# EAGLE design Callisto_Teknic_MSO_LSI_Relay_x_4 (EAGLE 9.6.2)
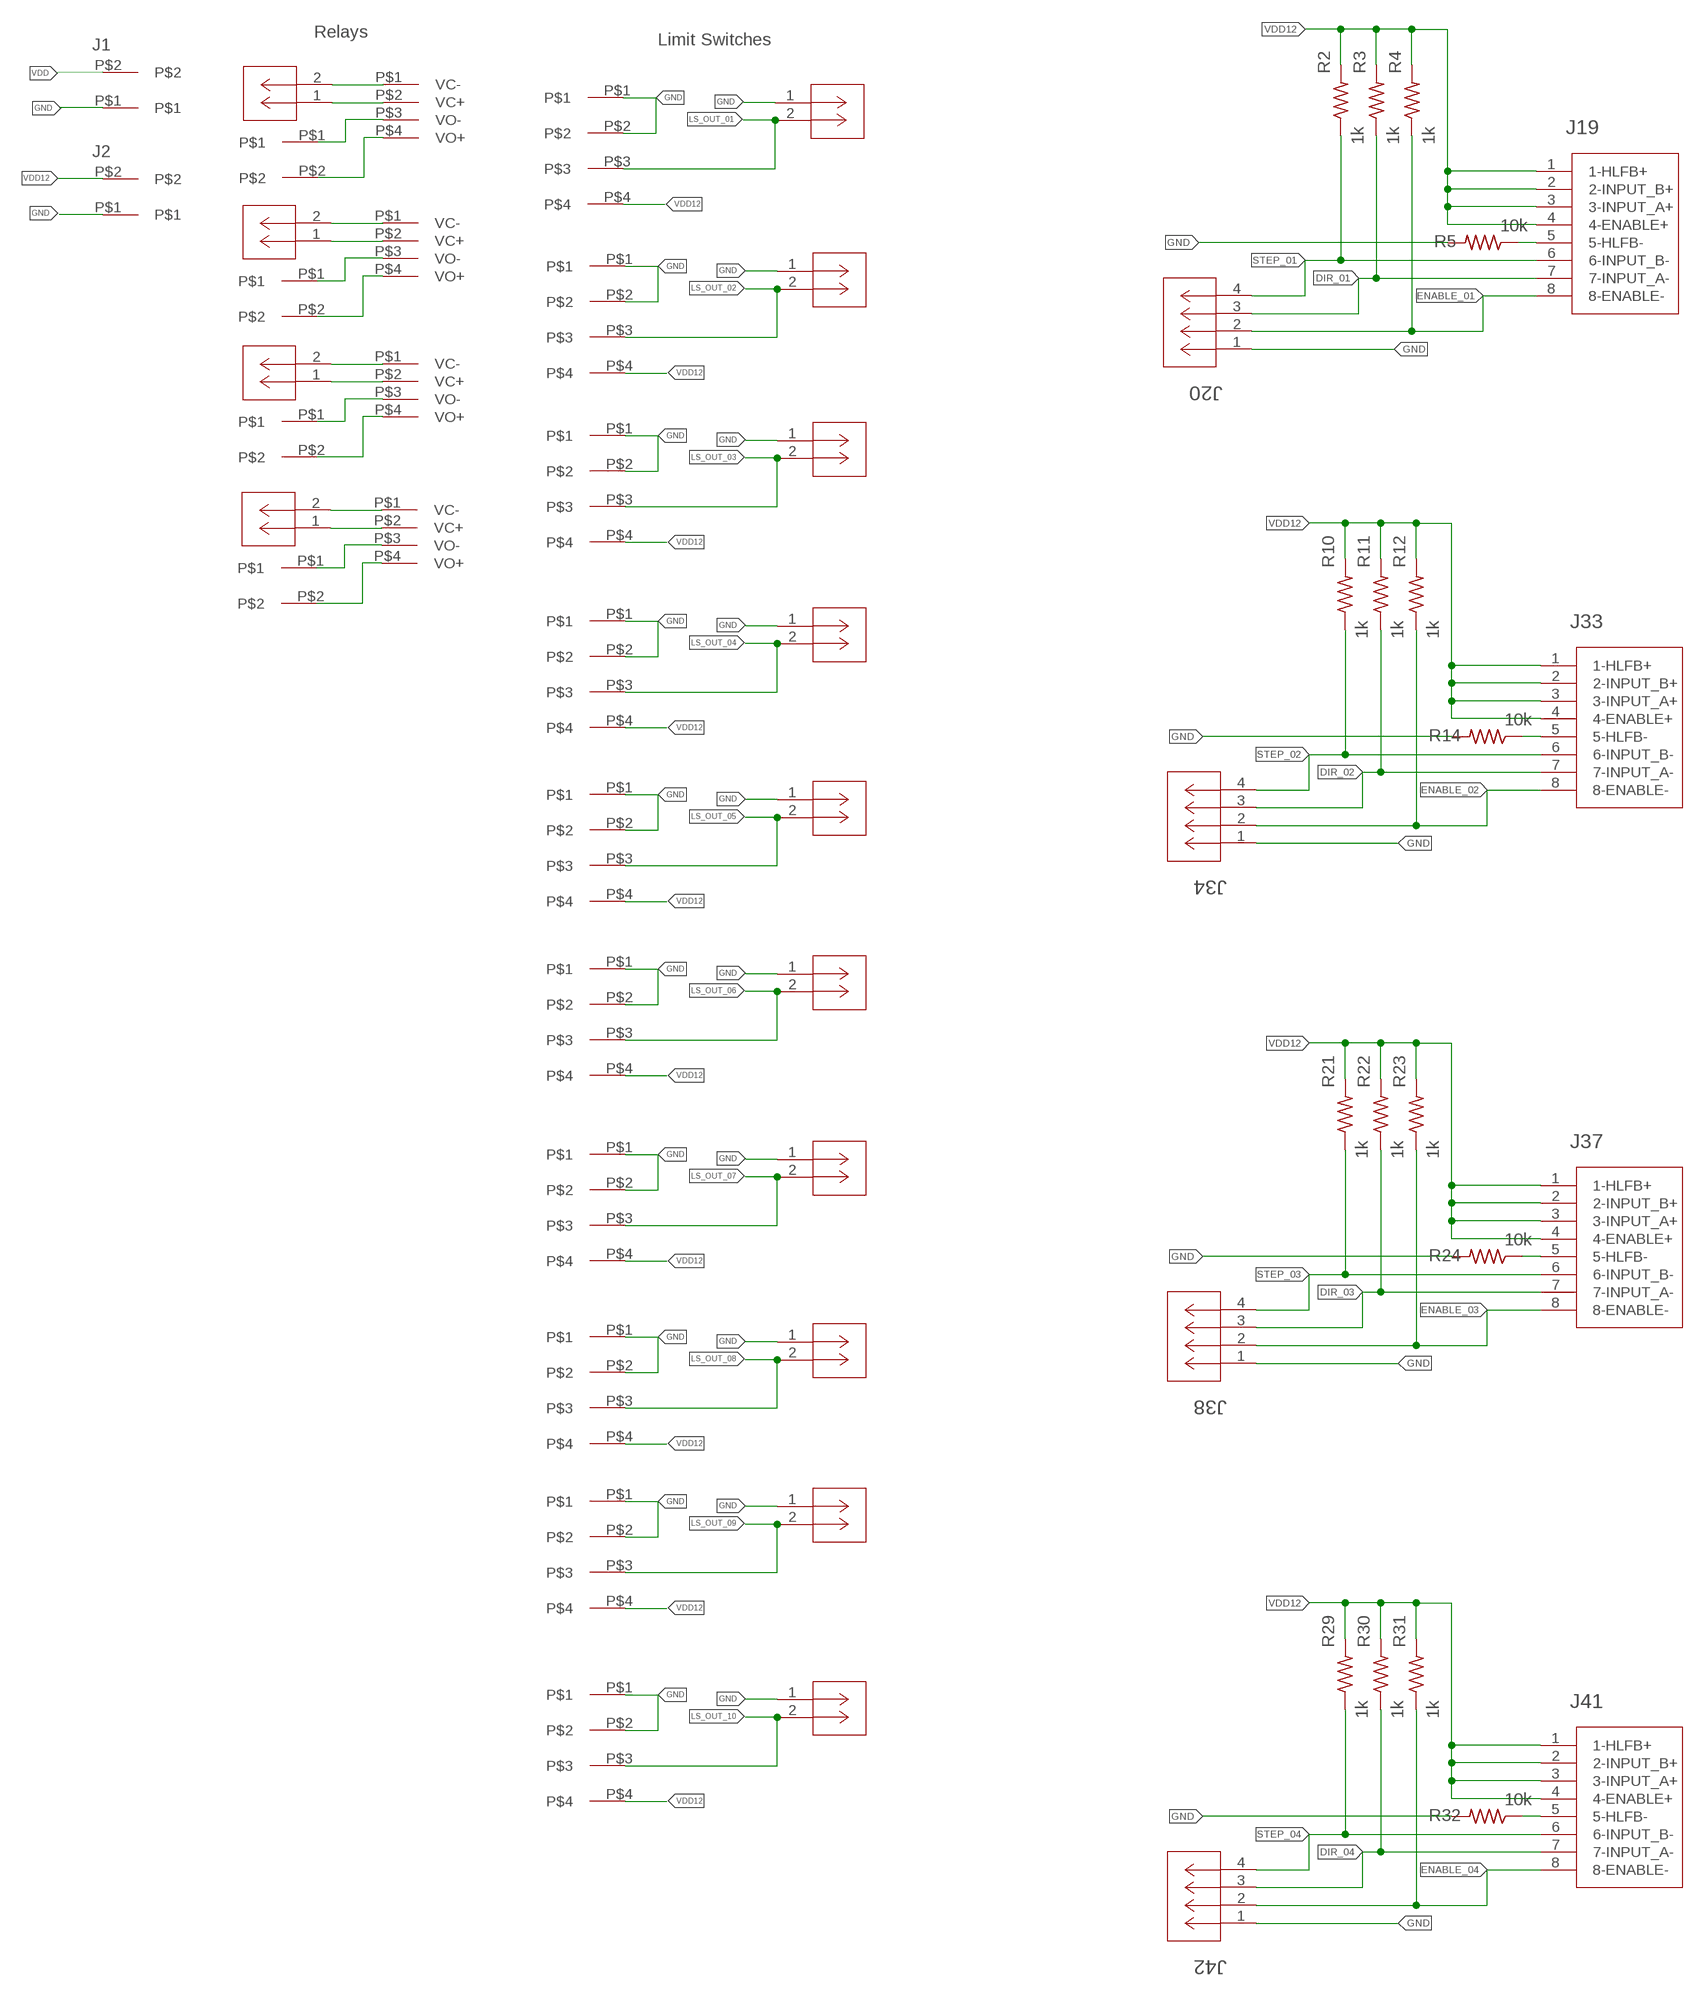
[diagram p0: schematic, sheet 1, part 1 of 2]
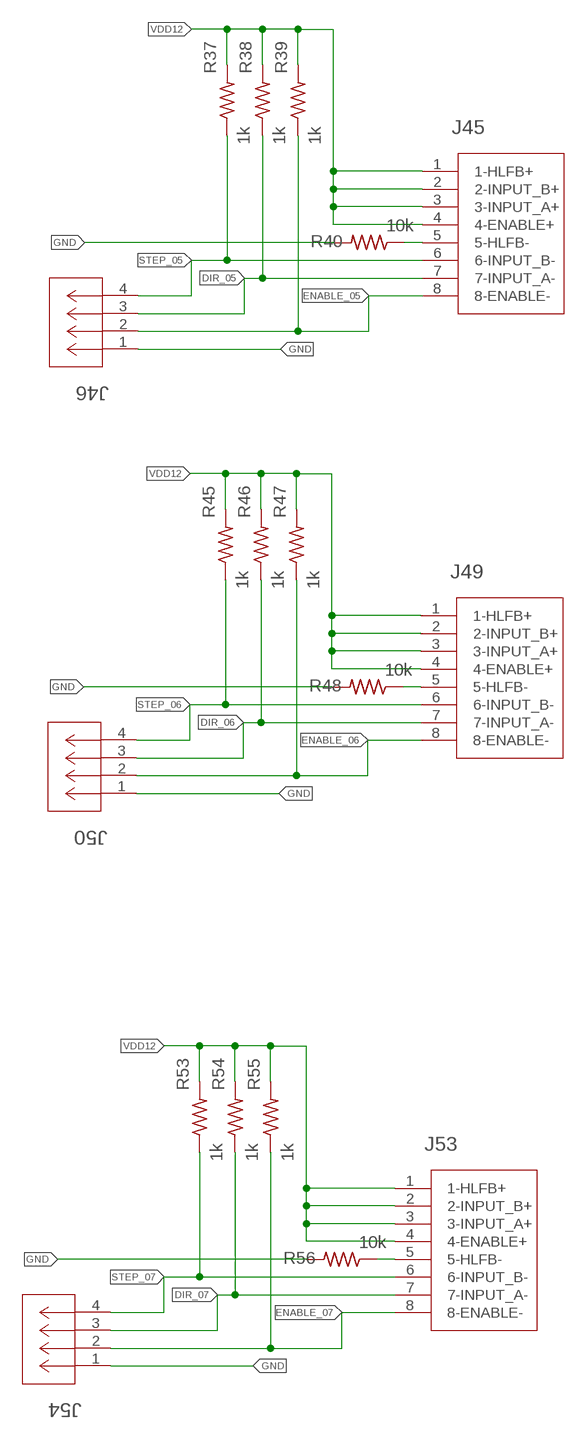
[diagram p1: schematic, sheet 1, part 2 of 2]

## Parts
J1  2-pos  3.81MM_1_X_2_RT_ANGLE_PLUG_HEADER  [2_3.81MM_PITCH]
J2  2-pos  3.81MM_1_X_2_RT_ANGLE_PLUG_HEADER  [2_3.81MM_PITCH]
J4  CONN_530470210_PICOBLADE_X_2  [CON_530470210_MOL]
J5  2-pos  3.81MM_1_X_2_RT_ANGLE_PLUG_HEADER  [2_3.81MM_PITCH]
J6  CONN_530470210_PICOBLADE_X_2  [CON_530470210_MOL]
J7  2-pos  3.81MM_1_X_2_RT_ANGLE_PLUG_HEADER  [2_3.81MM_PITCH]
J8  CONN_530470210_PICOBLADE_X_2  [CON_530470210_MOL]
J9  2-pos  3.81MM_1_X_2_RT_ANGLE_PLUG_HEADER  [2_3.81MM_PITCH]
J10  CONN_530470210_PICOBLADE_X_2  [CON_530470210_MOL]
J11  2-pos  3.81MM_1_X_2_RT_ANGLE_PLUG_HEADER  [2_3.81MM_PITCH]
J13  CONN_530470210_PICOBLADE_X_2  [CON_530470210_MOL]
J14  4-pos  3.81MM_1_X_4_RT_ANGLE_PLUG_HEADER  [1X4_3.81MM_PITCH]
J15  CONN_530470210_PICOBLADE_X_2  [CON_530470210_MOL]
J16  4-pos  3.81MM_1_X_4_RT_ANGLE_PLUG_HEADER  [1X4_3.81MM_PITCH]
J17  CONN_530470210_PICOBLADE_X_2  [CON_530470210_MOL]
J18  4-pos  3.81MM_1_X_4_RT_ANGLE_PLUG_HEADER  [1X4_3.81MM_PITCH]
J19  TEKNIC_8PIN_MOTOR  [CON_39281083]
J20  CONN_530470410_PICOBLADE_X_4  [CON_530470410_MOL]
J21  CONN_530470210_PICOBLADE_X_2  [CON_530470210_MOL]
J22  4-pos  3.81MM_1_X_4_RT_ANGLE_PLUG_HEADER  [1X4_3.81MM_PITCH]
J23  CONN_530470210_PICOBLADE_X_2  [CON_530470210_MOL]
J24  4-pos  3.81MM_1_X_4_RT_ANGLE_PLUG_HEADER  [1X4_3.81MM_PITCH]
J25  CONN_530470210_PICOBLADE_X_2  [CON_530470210_MOL]
J26  4-pos  3.81MM_1_X_4_RT_ANGLE_PLUG_HEADER  [1X4_3.81MM_PITCH]
J27  CONN_530470210_PICOBLADE_X_2  [CON_530470210_MOL]
J28  4-pos  3.81MM_1_X_4_RT_ANGLE_PLUG_HEADER  [1X4_3.81MM_PITCH]
J29  CONN_530470210_PICOBLADE_X_2  [CON_530470210_MOL]
J30  4-pos  3.81MM_1_X_4_RT_ANGLE_PLUG_HEADER  [1X4_3.81MM_PITCH]
J31  CONN_530470210_PICOBLADE_X_2  [CON_530470210_MOL]
J32  4-pos  3.81MM_1_X_4_RT_ANGLE_PLUG_HEADER  [1X4_3.81MM_PITCH]
J33  TEKNIC_8PIN_MOTOR  [CON_39281083]
J34  CONN_530470410_PICOBLADE_X_4  [CON_530470410_MOL]
J37  TEKNIC_8PIN_MOTOR  [CON_39281083]
J38  CONN_530470410_PICOBLADE_X_4  [CON_530470410_MOL]
J39  CONN_530470210_PICOBLADE_X_2  [CON_530470210_MOL]
J40  4-pos  3.81MM_1_X_4_RT_ANGLE_PLUG_HEADER  [1X4_3.81MM_PITCH]
J41  TEKNIC_8PIN_MOTOR  [CON_39281083]
J42  CONN_530470410_PICOBLADE_X_4  [CON_530470410_MOL]
J45  TEKNIC_8PIN_MOTOR  [CON_39281083]
J46  CONN_530470410_PICOBLADE_X_4  [CON_530470410_MOL]
J49  TEKNIC_8PIN_MOTOR  [CON_39281083]
J50  CONN_530470410_PICOBLADE_X_4  [CON_530470410_MOL]
J53  TEKNIC_8PIN_MOTOR  [CON_39281083]
J54  CONN_530470410_PICOBLADE_X_4  [CON_530470410_MOL]
R2  1k  R_0805  [0805]
R3  1k  R_0805  [0805]
R4  1k  R_0805  [0805]
R5  10k  R_0805  [0805]
R10  1k  R_0805  [0805]
R11  1k  R_0805  [0805]
R12  1k  R_0805  [0805]
R14  10k  R_0805  [0805]
R21  1k  R_0805  [0805]
R22  1k  R_0805  [0805]
R23  1k  R_0805  [0805]
R24  10k  R_0805  [0805]
R29  1k  R_0805  [0805]
R30  1k  R_0805  [0805]
R31  1k  R_0805  [0805]
R32  10k  R_0805  [0805]
R37  1k  R_0805  [0805]
R38  1k  R_0805  [0805]
R39  1k  R_0805  [0805]
R40  10k  R_0805  [0805]
R45  1k  R_0805  [0805]
R46  1k  R_0805  [0805]
R47  1k  R_0805  [0805]
R48  10k  R_0805  [0805]
R53  1k  R_0805  [0805]
R54  1k  R_0805  [0805]
R55  1k  R_0805  [0805]
R56  10k  R_0805  [0805]
U$1  RELAY_KYOTO_KF0604D  [RELAY_KYOTO_KF0604D]
U$2  RELAY_KYOTO_KF0604D  [RELAY_KYOTO_KF0604D]
U$3  RELAY_KYOTO_KF0604D  [RELAY_KYOTO_KF0604D]
U$4  RELAY_KYOTO_KF0604D  [RELAY_KYOTO_KF0604D]

## Nets
DIR_01: J19.7(7-INPUT_A-) J20.3 R3.1
DIR_02: J33.7(7-INPUT_A-) J34.3 R11.1
DIR_03: J37.7(7-INPUT_A-) J38.3 R22.1
DIR_04: J41.7(7-INPUT_A-) J42.3 R30.1
DIR_05: J45.7(7-INPUT_A-) J46.3 R38.1
DIR_06: J49.7(7-INPUT_A-) J50.3 R46.1
DIR_07: J53.7(7-INPUT_A-) J54.3 R54.1
ENABLE_01: J19.8(8-ENABLE-) J20.2 R4.1
ENABLE_02: J33.8(8-ENABLE-) J34.2 R12.1
ENABLE_03: J37.8(8-ENABLE-) J38.2 R23.1
ENABLE_04: J41.8(8-ENABLE-) J42.2 R31.1
ENABLE_05: J45.8(8-ENABLE-) J46.2 R39.1
ENABLE_06: J49.8(8-ENABLE-) J50.2 R47.1
ENABLE_07: J53.8(8-ENABLE-) J54.2 R55.1
GND: J1.P$1 J2.P$1 J13.1 J14.P$1 J14.P$2 J15.1 J16.P$1 J16.P$2 J17.1 J18.P$1 J18.P$2 J20.1 J21.1 J22.P$1 J22.P$2 J23.1 J24.P$1 J24.P$2 J25.1 J26.P$1 J26.P$2 J27.1 J28.P$1 J28.P$2 J29.1 J30.P$1 J30.P$2 J31.1 J32.P$1 J32.P$2 J34.1 J38.1 J39.1 J40.P$1 J40.P$2 J42.1 J46.1 J50.1 J54.1 R5.2 R14.2 R24.2 R32.2 R40.2 R48.2 R56.2
LS_OUT_01: J13.2 J14.P$3
LS_OUT_02: J17.2 J18.P$3
LS_OUT_03: J21.2 J22.P$3
LS_OUT_04: J25.2 J26.P$3
LS_OUT_05: J29.2 J30.P$3
LS_OUT_06: J15.2 J16.P$3
LS_OUT_07: J23.2 J24.P$3
LS_OUT_08: J27.2 J28.P$3
LS_OUT_09: J31.2 J32.P$3
LS_OUT_10: J39.2 J40.P$3
N$2: J19.5(5-HLFB-) R5.1
N$3: J4.1 U$1.P$2(VC+)
N$4: J4.2 U$1.P$1(VC-)
N$5: J5.P$1 U$1.P$3(VO-)
N$6: J5.P$2 U$1.P$4(VO+)
N$7: J6.1 U$2.P$2(VC+)
N$8: J6.2 U$2.P$1(VC-)
N$9: J7.P$1 U$2.P$3(VO-)
N$10: J7.P$2 U$2.P$4(VO+)
N$11: J8.1 U$3.P$2(VC+)
N$12: J8.2 U$3.P$1(VC-)
N$13: J9.P$1 U$3.P$3(VO-)
N$14: J9.P$2 U$3.P$4(VO+)
N$15: J10.1 U$4.P$2(VC+)
N$16: J10.2 U$4.P$1(VC-)
N$17: J11.P$1 U$4.P$3(VO-)
N$18: J11.P$2 U$4.P$4(VO+)
N$20: J33.5(5-HLFB-) R14.1
N$22: J37.5(5-HLFB-) R24.1
N$24: J41.5(5-HLFB-) R32.1
N$26: J45.5(5-HLFB-) R40.1
N$28: J49.5(5-HLFB-) R48.1
N$30: J53.5(5-HLFB-) R56.1
STEP_01: J19.6(6-INPUT_B-) J20.4 R2.1
STEP_02: J33.6(6-INPUT_B-) J34.4 R10.1
STEP_03: J37.6(6-INPUT_B-) J38.4 R21.1
STEP_04: J41.6(6-INPUT_B-) J42.4 R29.1
STEP_05: J45.6(6-INPUT_B-) J46.4 R37.1
STEP_06: J49.6(6-INPUT_B-) J50.4 R45.1
STEP_07: J53.6(6-INPUT_B-) J54.4 R53.1
VDD: J1.P$2
VDD12: J2.P$2 J14.P$4 J16.P$4 J18.P$4 J19.1(1-HLFB+) J19.2(2-INPUT_B+) J19.3(3-INPUT_A+) J19.4(4-ENABLE+) J22.P$4 J24.P$4 J26.P$4 J28.P$4 J30.P$4 J32.P$4 J33.1(1-HLFB+) J33.2(2-INPUT_B+) J33.3(3-INPUT_A+) J33.4(4-ENABLE+) J37.1(1-HLFB+) J37.2(2-INPUT_B+) J37.3(3-INPUT_A+) J37.4(4-ENABLE+) J40.P$4 J41.1(1-HLFB+) J41.2(2-INPUT_B+) J41.3(3-INPUT_A+) J41.4(4-ENABLE+) J45.1(1-HLFB+) J45.2(2-INPUT_B+) J45.3(3-INPUT_A+) J45.4(4-ENABLE+) J49.1(1-HLFB+) J49.2(2-INPUT_B+) J49.3(3-INPUT_A+) J49.4(4-ENABLE+) J53.1(1-HLFB+) J53.2(2-INPUT_B+) J53.3(3-INPUT_A+) J53.4(4-ENABLE+) R2.2 R3.2 R4.2 R10.2 R11.2 R12.2 R21.2 R22.2 R23.2 R29.2 R30.2 R31.2 R37.2 R38.2 R39.2 R45.2 R46.2 R47.2 R53.2 R54.2 R55.2

## Notes on the sheet
- Relays
- Limit Switches

## Library data of the parts
J1 J2 J5 J7 J9 J11 = 3D_MIG_Controller:3.81MM_1_X_2_RT_ANGLE_PLUG_HEADER: TERM BLOCK HDR 2POS 90DEG 3.81MM; PARTNO: 691322310002
J4 J6 J8 J10 J13 J15 J17 J21 J23 J25 J27 J29 J31 J39 = 3D_MIG_Controller:CONN_530470210_PICOBLADE_X_2; COPYRIGHT: Copyright (C) 2022 Ultra Librarian. All rights reserved.; MANUFACTURER_PART_NUMBER: 530470210; MFR_NAME: Molex Connector Corporation
J14 J16 J18 J22 J24 J26 J28 J30 J32 J40 = 3D_MIG_Controller:3.81MM_1_X_4_RT_ANGLE_PLUG_HEADER: 4 Position Terminal Block Header, Male Pins, Shrouded (4 Side) 0.150" (3.81mm) 90°, Right Angle - Through Hole; PARTNO: 691322310004
J19 J33 J37 J41 J45 J49 J53 = 3D_MIG_Controller:TEKNIC_8PIN_MOTOR; COPYRIGHT: Copyright (C) 2022 Ultra Librarian. All rights reserved.; MANUFACTURER_PART_NUMBER: 39281083; MFR_NAME: Molex Connector Corporation
J20 J34 J38 J42 J46 J50 J54 = 3D_MIG_Controller:CONN_530470410_PICOBLADE_X_4; COPYRIGHT: Copyright (C) 2022 Ultra Librarian. All rights reserved.; MANUFACTURER_PART_NUMBER: 530470410; MFR_NAME: Molex Connector Corporation
R2-R5 R10-R12 R14 R21-R24 R29-R32 R37-R40 R45-R48 R53-R56 = 3D_MIG_Controller:R_0805
U$1-U$4 = 3D_MIG_Controller:RELAY_KYOTO_KF0604D

## Board
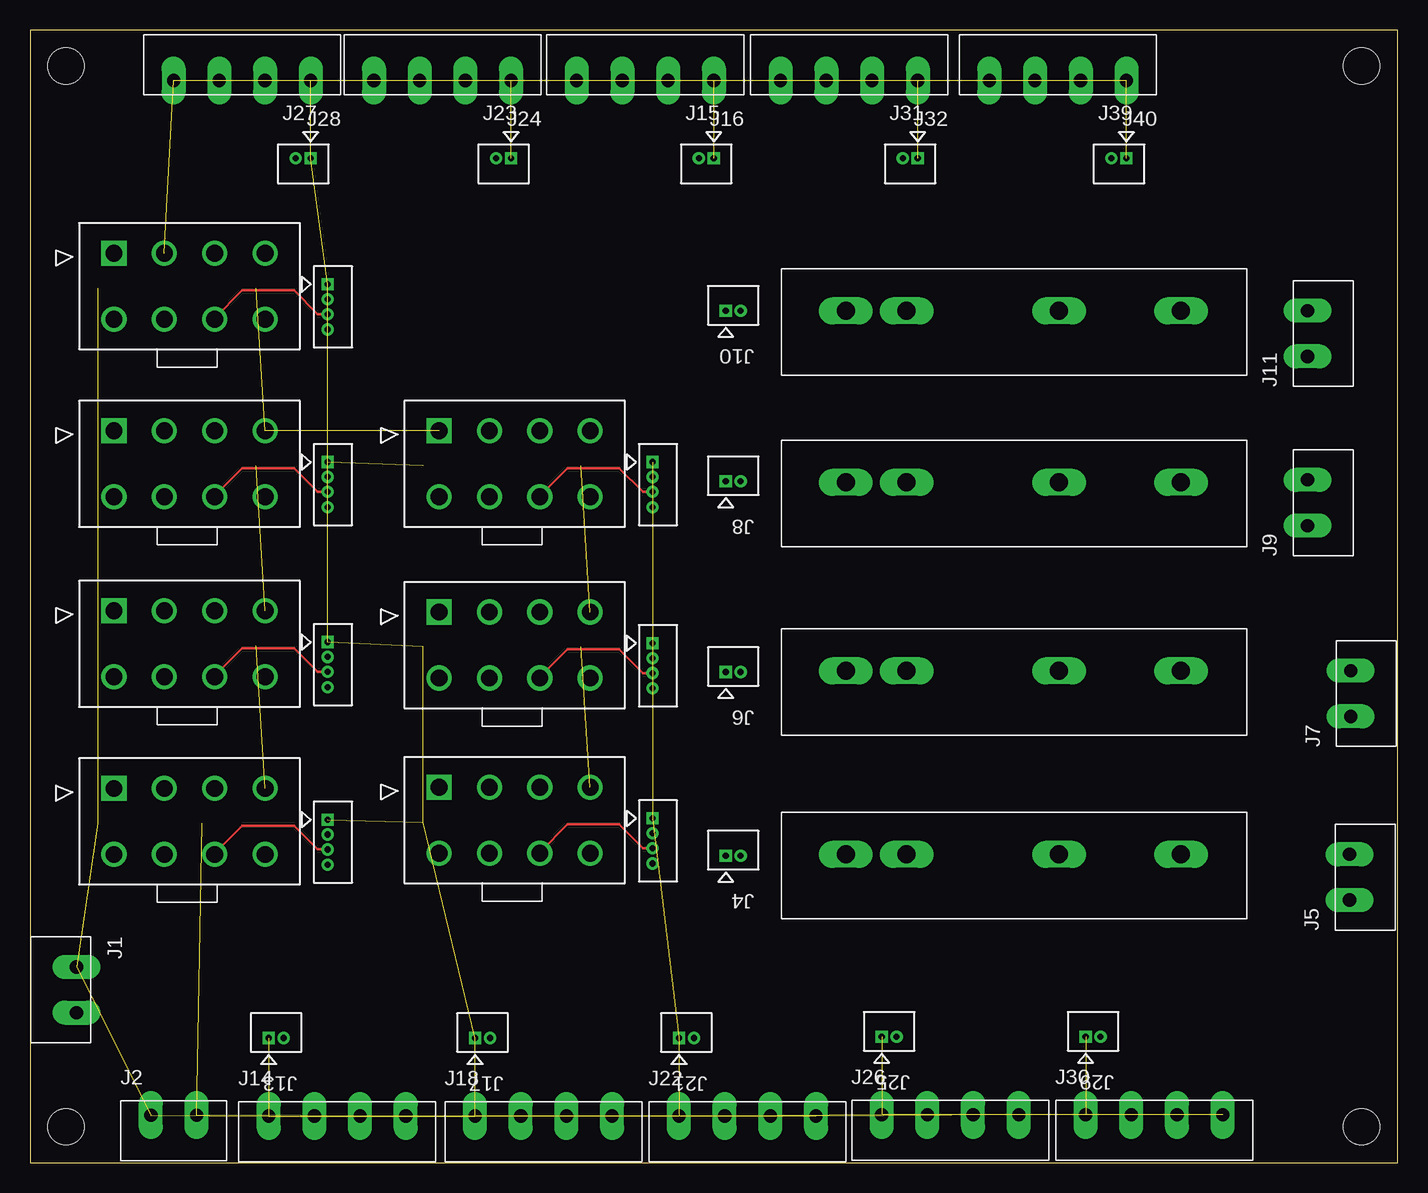
[diagram p2: board, top side]
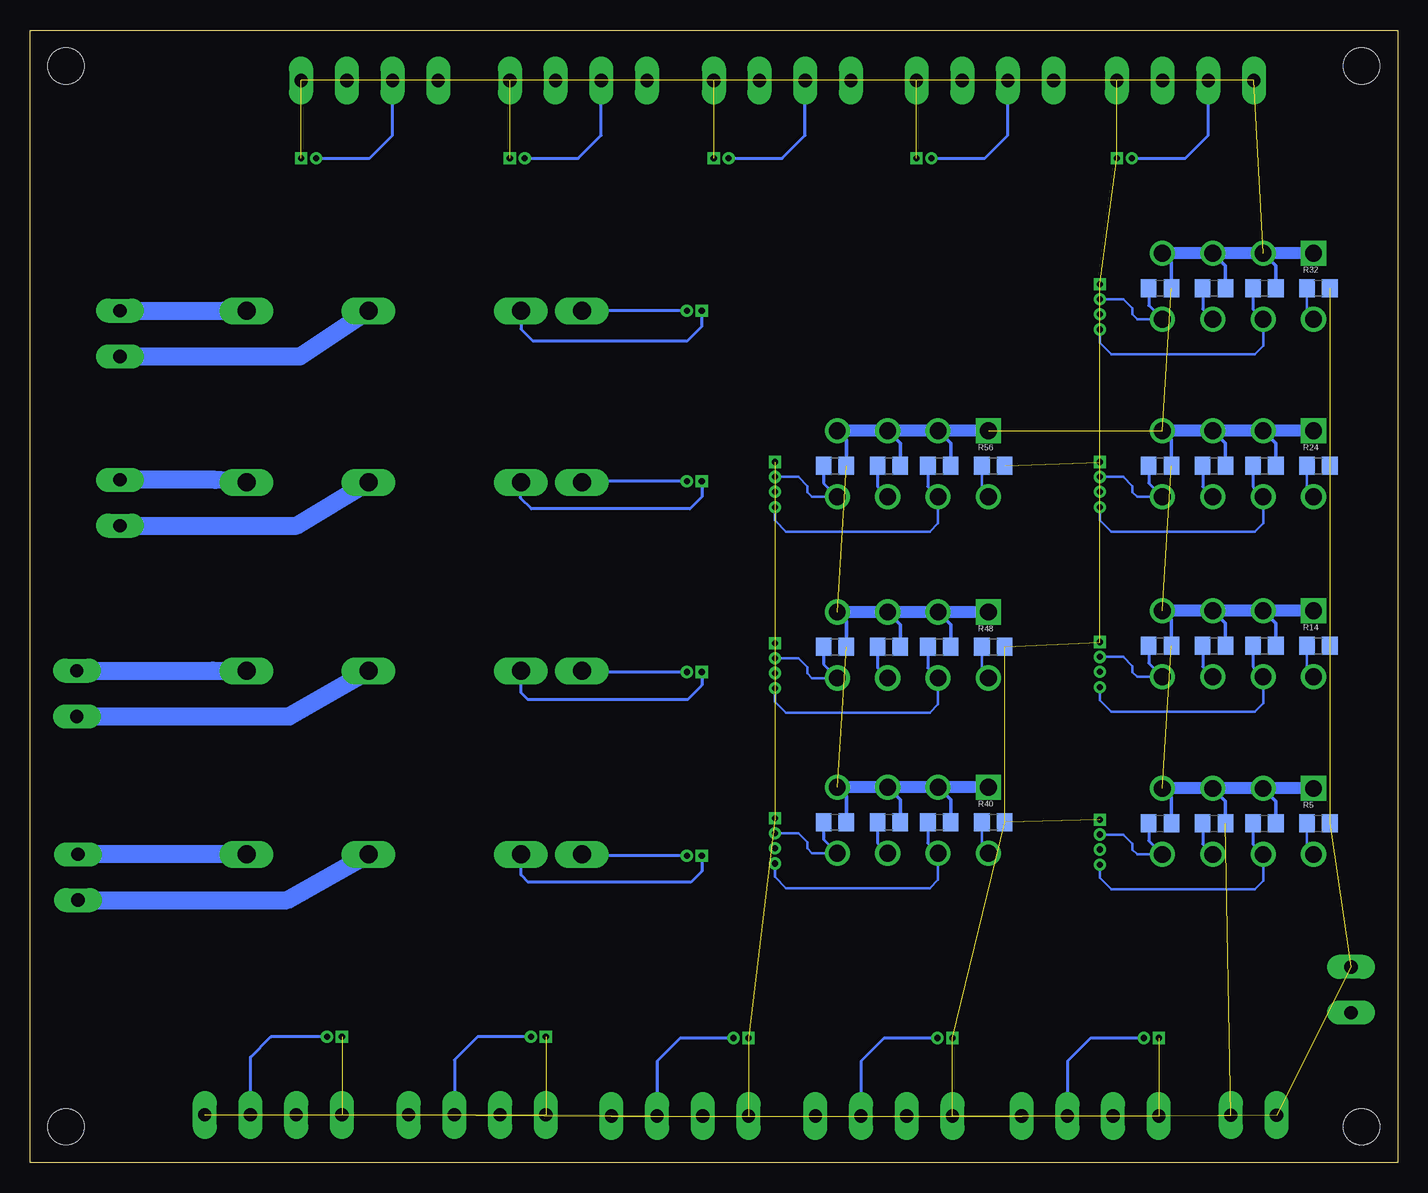
[diagram p3: board, bottom side, seen from below]

Size 114 x 94.4 mm. Coordinates in mm from the lower left corner, seen from the top.
Outline: 0,0 114,0 114,94.4 0,94.4 0,0
Copper layers (1*16): Top 0.035mm / dielectric 1.5mm / Bottom 0.035mm
Design rules "default": minimum track width 6mil, minimum drill 0.2mm, track to track 6mil, track to pad 6mil, pad to pad 6mil, via to via 6mil, smd to smd 6mil, copper to edge 40mil, drill to drill 6mil, minimum pad ring 10mil, minimum via ring 4mil, stop-mask expansion 4mil, vias tented up to drill 0mil, thermal gap 10mil
Holes 3 mm at 3,3 111,3 111,91.4 3,91.4

### Footprints (pad centres in the part's own frame; a part is rotated, then mirrored left to right if it is on the bottom)
2_3.81MM_PITCH = drill 1.1 pad 2 long: P$1 0,0; P$2 3.81,0
CON_530470210_MOL = drill 0.508 pad 0.838 square: 1 0,0 | drill 0.508 pad 0.838: 2 -1.245,0
1X4_3.81MM_PITCH = drill 1.1 pad 2 long: P$1 0,0; P$2 3.81,0; P$3 7.62,0; P$4 11.43,0
CON_39281083 = drill 1.397 pad 1.905 square: 1 12.6,-5.5 | drill 1.397 pad 1.905: 2 8.4,-5.5; 3 4.2,-5.5; 4 0,-5.5; 5 12.6,0; 6 8.4,0; 7 4.2,0; 8 0,0
CON_530470410_MOL = drill 0.508 pad 0.838 square: 1 0,0 | drill 0.508 pad 0.838: 2 -1.245,0; 3 -2.489,0; 4 -3.759,0
0805 = smd 1.3 x 1.5: 1 -0.95,0; 2 0.95,0
RELAY_KYOTO_KF0604D = drill 1.5 long: P$1 0,0; P$2 -5.08,0; P$3 -17.78,0; P$4 -27.94,0

### Placement (x,y rotation side)
J1  3.88,16.32 270 top
J2  10.08,3.97 0 top
J4  58,25.6 180 top
J5  110,21.9 90 top
J6  58,40.9 180 top
J7  110.1,37.2 90 top
J8  58,56.8 180 top
J9  106.5,53.1 90 top
J10  58,71 180 top
J11  106.5,67.2 90 top
J13  19.9,10.4 180 top
J14  19.9,3.9 0 top
J15  57,83.7 0 top
J16  57,90.2 180 top
J17  37.1,10.4 180 top
J18  37.1,3.9 0 top
J19  19.6,25.7 180 top
J20  24.8,28.6 90 top
J21  54.1,10.4 180 top
J22  54.1,3.9 0 top
J23  40.1,83.7 0 top
J24  40.1,90.2 180 top
J25  71,10.5 180 top
J26  71,4 0 top
J27  23.4,83.7 0 top
J28  23.4,90.2 180 top
J29  88,10.5 180 top
J30  88,4 0 top
J31  74,83.7 0 top
J32  74,90.2 180 top
J33  19.6,40.5 180 top
J34  24.8,43.4 90 top
J37  19.6,55.5 180 top
J38  24.8,58.4 90 top
J39  91.4,83.7 0 top
J40  91.4,90.2 180 top
J41  19.6,70.3 180 top
J42  24.8,73.2 90 top
J45  46.7,25.8 180 top
J46  51.9,28.7 90 top
J49  46.7,40.4 180 top
J50  51.9,43.3 90 top
J53  46.7,55.5 180 top
J54  51.9,58.4 90 top
R2  11.1,28.3 0 bottom
R3  15.3,28.3 0 bottom
R4  19.8,28.3 0 bottom
R5  6.6,28.3 0 bottom
R10  11.1,43.1 0 bottom
R11  15.3,43.1 0 bottom
R12  19.8,43.1 0 bottom
R14  6.6,43.1 0 bottom
R21  11.1,58.1 0 bottom
R22  15.3,58.1 0 bottom
R23  19.8,58.1 0 bottom
R24  6.6,58.1 0 bottom
R29  11.1,72.9 0 bottom
R30  15.3,72.9 0 bottom
R31  19.8,72.9 0 bottom
R32  6.6,72.9 0 bottom
R37  38.2,28.4 0 bottom
R38  42.4,28.4 0 bottom
R39  46.9,28.4 0 bottom
R40  33.7,28.4 0 bottom
R45  38.2,43 0 bottom
R46  42.4,43 0 bottom
R47  46.9,43 0 bottom
R48  33.7,43 0 bottom
R53  38.2,58.1 0 bottom
R54  42.4,58.1 0 bottom
R55  46.9,58.1 0 bottom
R56  33.7,58.1 0 bottom
U$1  68,25.7 180 top
U$2  68,41 180 top
U$3  68,56.7 180 top
U$4  68,71 180 top

### Tracks (layer width: path | path; a pad name or v marks a point on that pad's centre or on a via)
DIR_01
  Top 0.2: J20.3 23.99,26.11 22,28.1 17.7,28.1 15.4,25.8 J19.7
  Bottom 0.254: R3.1 16.25,26.55 J19.7
DIR_02
  Top 0.2: J34.3 23.99,40.91 22,42.9 17.7,42.9 15.4,40.6 J33.7
  Bottom 0.254: R11.1 16.25,41.35 J33.7
DIR_03
  Top 0.2: J38.3 23.99,55.91 22,57.9 17.7,57.9 15.4,55.6 J37.7
  Bottom 0.254: R22.1 16.25,56.35 J37.7
DIR_04
  Top 0.2: J42.3 23.99,70.71 22,72.7 17.7,72.7 15.4,70.4 J41.7
  Bottom 0.254: R30.1 16.25,71.15 J41.7
DIR_05
  Top 0.2: J46.3 51.09,26.21 49.1,28.2 44.8,28.2 42.5,25.9 J45.7
  Bottom 0.254: R38.1 43.35,26.65 J45.7
DIR_06
  Top 0.2: J50.3 51.09,40.81 49.1,42.8 44.8,42.8 42.5,40.5 J49.7
  Bottom 0.254: R46.1 43.35,41.25 J49.7
DIR_07
  Top 0.2: J54.3 51.09,55.91 49.1,57.9 44.8,57.9 42.5,55.6 J53.7
  Bottom 0.254: R54.1 43.35,56.35 J53.7
ENABLE_01
  Bottom 0.2: J20.2 22.86,27.36 22.1,26.6 22.1,26.1 21.7,25.7 J19.8
  Bottom 0.254: R4.1 20.75,26.85 J19.8
ENABLE_02
  Bottom 0.2: J34.2 22.86,42.16 22.1,41.4 22.1,40.9 21.7,40.5 J33.8
  Bottom 0.254: R12.1 20.75,41.65 J33.8
ENABLE_03
  Bottom 0.2: J38.2 22.86,57.16 22.1,56.4 22.1,55.9 21.7,55.5 J37.8
  Bottom 0.254: R23.1 20.75,56.65 J37.8
ENABLE_04
  Bottom 0.2: J42.2 22.86,71.95 22.1,71.2 22.1,70.7 21.7,70.3 J41.8
  Bottom 0.254: R31.1 20.75,71.45 J41.8
ENABLE_05
  Bottom 0.2: J46.2 49.95,27.45 49.2,26.7 49.2,26.2 48.8,25.8 J45.8
  Bottom 0.254: R39.1 47.85,26.95 J45.8
ENABLE_06
  Bottom 0.2: J50.2 49.95,42.05 49.2,41.3 49.2,40.8 48.8,40.4 J49.8
  Bottom 0.254: R47.1 47.85,41.55 J49.8
ENABLE_07
  Bottom 0.2: J54.2 49.95,57.16 49.2,56.4 49.2,55.9 48.8,55.5 J53.8
  Bottom 0.254: R55.1 47.85,56.65 J53.8
GND  (45 unrouted)
LS_OUT_01
  Bottom 0.254: J13.2 25.6,10.4 27.52,8.48 J14.P$3
LS_OUT_02
  Bottom 0.254: J17.2 42.8,10.4 44.72,8.48 J18.P$3
LS_OUT_03
  Bottom 0.254: J21.2 59.8,10.4 61.72,8.48 J22.P$3
LS_OUT_04
  Bottom 0.254: J25.2 76.7,10.5 78.62,8.58 J26.P$3
LS_OUT_05
  Bottom 0.254: J30.P$3 95.62,8.8 93.92,10.5 J29.2
LS_OUT_06
  Bottom 0.254: J15.2 51.3,83.7 49.38,85.62 J16.P$3
LS_OUT_07
  Bottom 0.254: J23.2 34.4,83.7 32.48,85.62 J24.P$3
LS_OUT_08
  Bottom 0.254: J27.2 17.7,83.7 15.78,85.62 J28.P$3
LS_OUT_09
  Bottom 0.254: J31.2 68.3,83.7 66.38,85.62 J32.P$3
LS_OUT_10
  Bottom 0.254: J39.2 85.7,83.7 83.78,85.62 J40.P$3
N$2
  Bottom 0.2: J19.5 7.55,26.25 R5.1
N$3
  Bottom 0.254: J4.1 58,24.3 58.9,23.4 72.48,23.4 73.08,24 U$1.P$2
N$4
  Bottom 0.254: J4.2 67.9,25.6 U$1.P$1
N$5
  Bottom 1.5: J5.P$1 92.58,21.9 U$1.P$3
N$6
  Bottom 1.5: U$1.P$4 J5.P$2
N$7
  Bottom 0.254: J6.1 58,39.8 59.2,38.6 72.5,38.6 73.08,39.18 U$2.P$2
N$8
  Bottom 0.254: J6.2 67.9,40.9 U$2.P$1
N$9
  Bottom 1.5: J7.P$1 92.38,37.2 U$2.P$3
N$10
  Bottom 1.5: J7.P$2 98.75,41.01 U$2.P$4
N$11
  Bottom 0.254: J8.1 58,55.5 59,54.5 72.2,54.5 73.1,55.4 73.1,56.68 U$3.P$2
N$12
  Bottom 0.254: J8.2 67.9,56.8 U$3.P$1
N$13
  Bottom 1.5: J9.P$1 91.78,53.1 U$3.P$3
N$14
  Bottom 1.5: U$3.P$4 98.55,56.91 J9.P$2
N$15
  Bottom 0.254: J10.1 58,69.7 59.2,68.5 72.1,68.5 73.08,69.48 U$4.P$2
N$16
  Bottom 0.254: J10.2 U$4.P$1
N$17
  Bottom 1.5: J11.P$1 91.48,67.2 U$4.P$3
N$18
  Bottom 1.5: J11.P$2 97.85,71.01 U$4.P$4
N$20
  Bottom 0.2: J33.5 7.55,41.05 R14.1
N$22
  Bottom 0.2: J37.5 7.55,56.05 R24.1
N$24
  Bottom 0.2: J41.5 7.55,70.85 R32.1
N$26
  Bottom 0.2: J45.5 34.65,26.35 R40.1
N$28
  Bottom 0.2: J49.5 34.65,40.95 R48.1
N$30
  Bottom 0.2: J53.5 34.65,56.05 R56.1
STEP_01
  Bottom 0.2: J20.4 24.8,23.74 23.86,22.8 11.9,22.8 11.2,23.5 J19.6
  Bottom 0.254: R2.1 12.05,26.55 J19.6
STEP_02
  Bottom 0.2: J34.4 24.8,38.54 23.86,37.6 11.9,37.6 11.2,38.3 J33.6
  Bottom 0.254: R10.1 12.05,41.35 J33.6
STEP_03
  Bottom 0.2: J38.4 24.8,53.54 23.86,52.6 11.9,52.6 11.2,53.3 J37.6
  Bottom 0.254: R21.1 12.05,56.35 J37.6
STEP_04
  Bottom 0.2: J42.4 24.8,68.34 23.86,67.4 11.9,67.4 11.2,68.1 J41.6
  Bottom 0.254: R29.1 12.05,71.15 J41.6
STEP_05
  Bottom 0.2: J46.4 51.9,23.84 50.96,22.9 39,22.9 38.3,23.6 J45.6
  Bottom 0.254: R37.1 39.15,26.65 J45.6
STEP_06
  Bottom 0.2: J50.4 51.9,38.44 50.96,37.5 39,37.5 38.3,38.2 J49.6
  Bottom 0.254: R45.1 39.15,41.25 J49.6
STEP_07
  Bottom 0.2: J54.4 51.9,53.54 50.96,52.6 39,52.6 38.3,53.3 J53.6
  Bottom 0.254: R53.1 39.15,56.35 J53.6
VDD12  (17 unrouted)
  Bottom 0.305: R2.2 10.15,30.15 J19.2 | R3.2 14.35,30.15 J19.3 | R4.2 18.85,30.45 J19.4 | R10.2 10.15,44.95 J33.2 | R11.2 14.35,44.95 J33.3 | R12.2 18.85,45.25 J33.4 | R21.2 10.15,59.95 J37.2 | R22.2 14.35,59.95 J37.3 | R23.2 18.85,60.25 J37.4 | R29.2 10.15,74.75 J41.2 | R30.2 14.35,74.75 J41.3 | R31.2 18.85,75.05 J41.4 | R37.2 37.25,30.25 J45.2 | R38.2 41.45,30.25 J45.3 | R39.2 45.95,30.55 J45.4 | R45.2 37.25,44.85 J49.2 | R46.2 41.45,44.85 J49.3 | R47.2 45.95,45.15 J49.4 | R53.2 37.25,59.95 J53.2 | R54.2 41.45,59.95 J53.3 | R55.2 45.95,60.25 J53.4
  Bottom 1.016: J19.1 J19.2 J19.3 J19.4 | J33.1 J33.2 J33.3 J33.4 | J37.1 J37.2 J37.3 J37.4 | J41.1 J41.2 J41.3 J41.4 | J45.1 J45.2 J45.3 J45.4 | J49.1 J49.2 J49.3 J49.4 | J53.1 J53.2 J53.3 J53.4